# Altium schematic sheet Sheet1.SchDoc
size A4; ENG_APP_DATE: --/--/--; DSN_APP_DATE: --/--/--; CHK_APP_DATE: --/--/--; CheckedBy: CT-Energys; Author: CT-Energys; CompanyName: HTD COMPANY LIMITED; DrawnBy: CHITOAN; Engineer: CHITOAN; Organization: Altium Limited; Address1: HO CHI MINH CITY; Address2: VIETNAM; SheetNumber: 1; SheetTotal: 18
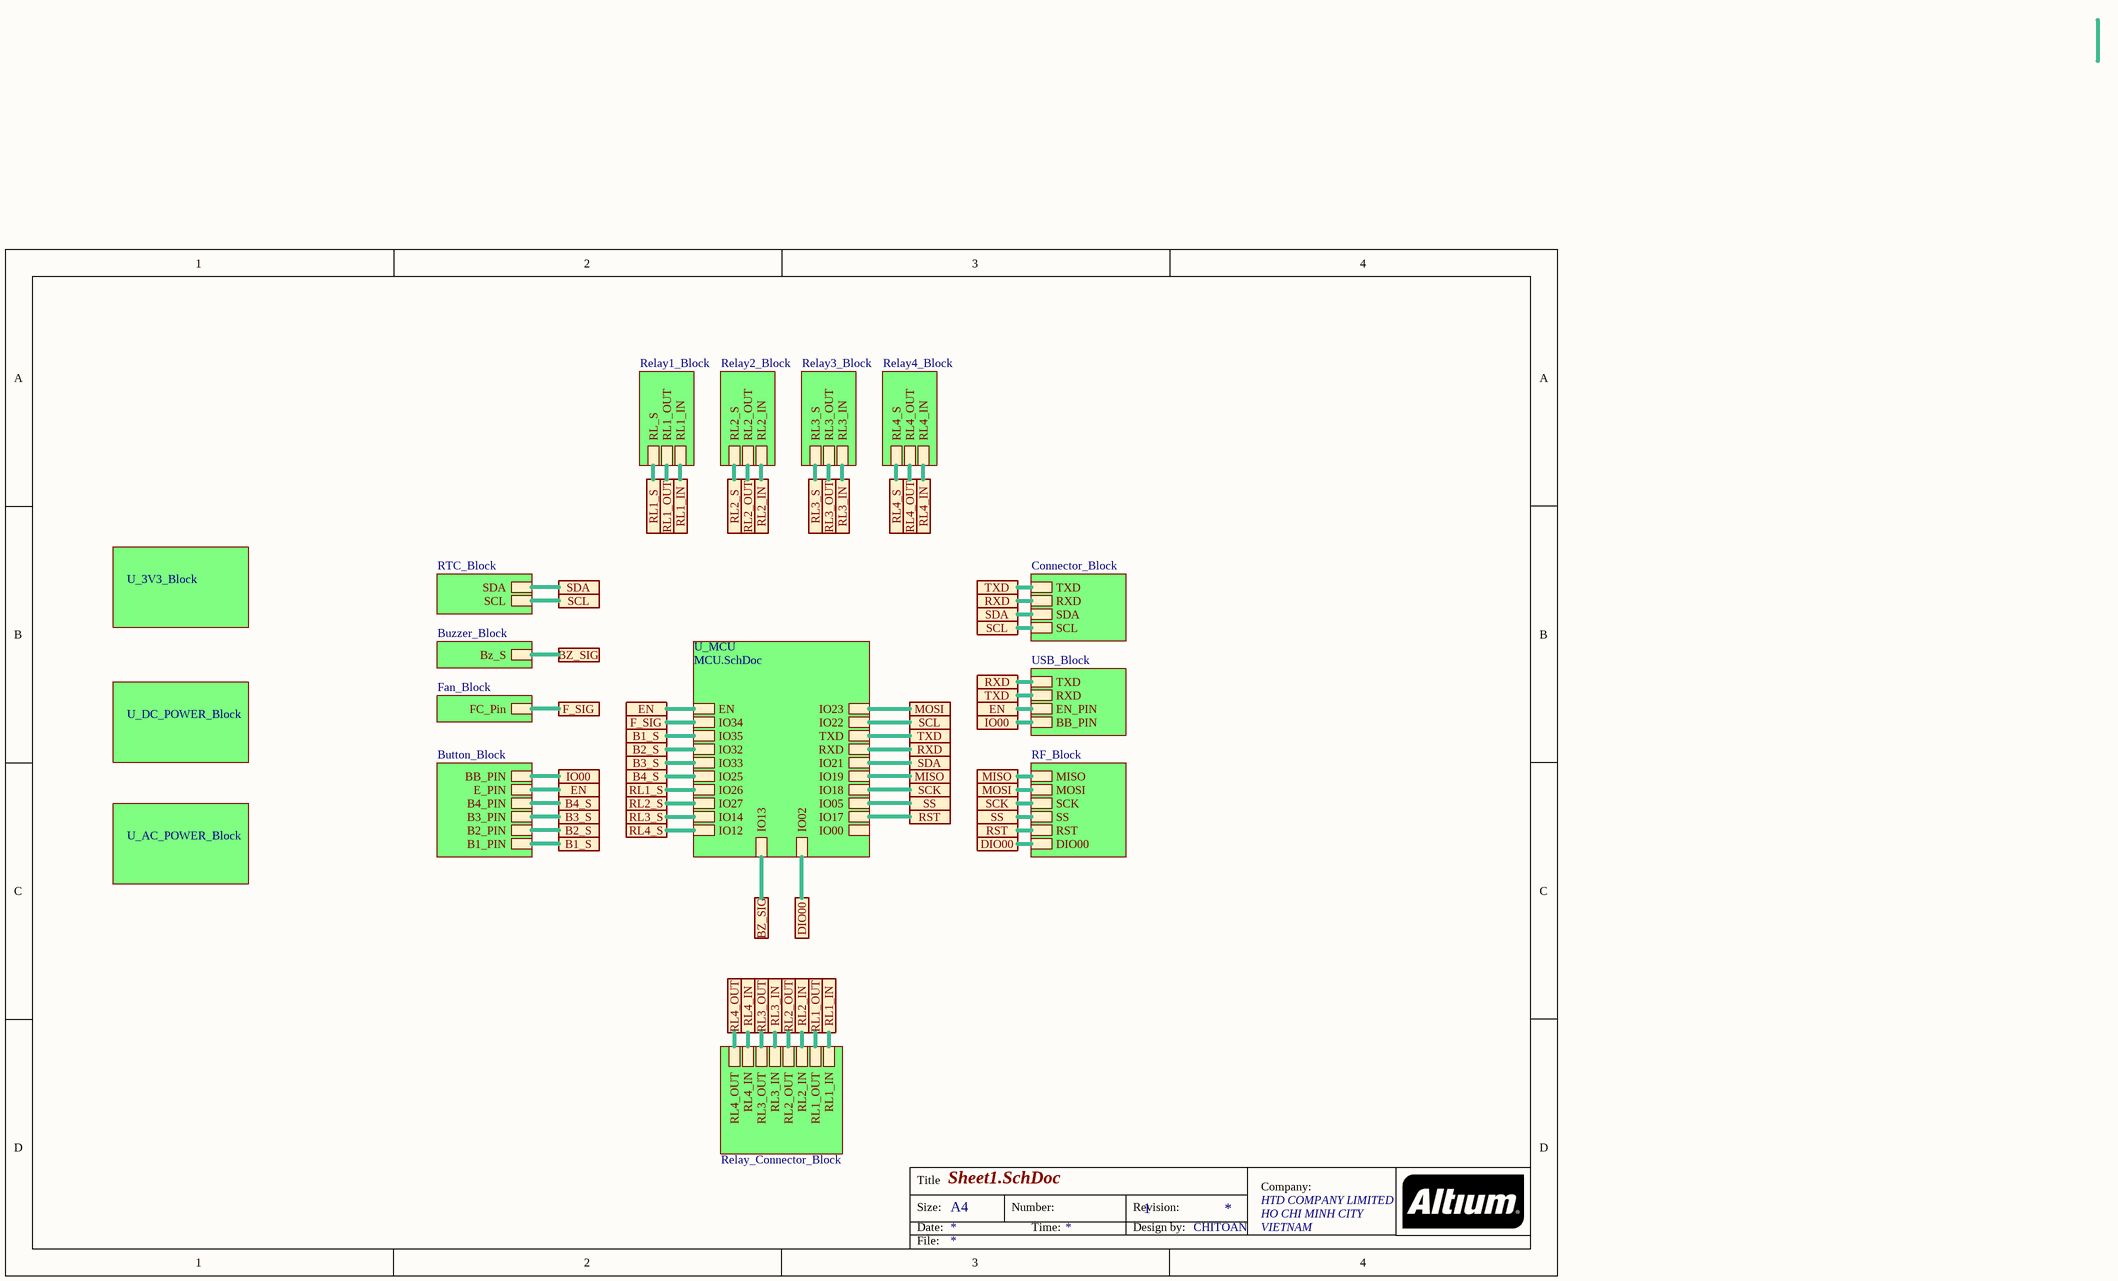
[diagram p0: Sheet1.SchDoc]

## Sub-sheets
Button_Block = Button_Block.SchDoc: B1_PIN, B2_PIN, B3_PIN, E_PIN, BB_PIN, B4_PIN
Buzzer_Block = Buzzer_Block.SchDoc: Bz_S
Connector_Block = Connector_Block.SchDoc: TXD, RXD, SDA, SCL
Fan_Block = Fan_Block.SchDoc: FC_Pin
Relay1_Block = Relay1_Block.SchDoc: RL_S, RL1_OUT, RL1_IN
Relay2_Block = Relay2_Block.SchDoc: RL2_S, RL2_OUT, RL2_IN
Relay3_Block = Relay3_Block.SchDoc: RL3_S, RL3_OUT, RL3_IN
Relay4_Block = Relay4_Block.SchDoc: RL4_S, RL4_OUT, RL4_IN
Relay_Connector_Block = Relay_Connector_Block.SchDoc: RL1_IN, RL1_OUT, RL2_IN, RL2_OUT, RL3_IN, RL3_OUT, RL4_IN, RL4_OUT
RF_Block = RF_Block.SchDoc: MISO, MOSI, SCK, SS, RST, DIO00
RTC_Block = RTC_Block.SchDoc: SCL, SDA
U_3V3_Block = 3V3_Block.SchDoc: no entries
U_AC_POWER_Block = AC_POWER_Block.SchDoc: no entries
U_DC_POWER_Block = DC_POWER_Block.SchDoc: no entries
U_MCU = MCU.SchDoc: EN, IO32, IO33, IO25, IO26, IO27, IO14, IO12, IO02, IO23, IO22, TXD, RXD, IO21, IO19, IO18, IO05, IO17, IO00, IO35, IO34, IO13
USB_Block = USB_Block.SchDoc: TXD, RXD, EN_PIN, BB_PIN

## Ports
B1_S, B2_S, B3_S, B4_S, BZ_SIG, DIO00, EN, F_SIG, IO00, MISO, MOSI, RL1_IN, RL1_OUT, RL1_S, RL2_IN, RL2_OUT, RL2_S, RL3_IN, RL3_OUT, RL3_S, RL4_IN, RL4_OUT, RL4_S, RST, RXD, SCK, SCL, SDA, SS, TXD

## Nets
B1_S: port B1_S, sheet Button_Block/B1_PIN, sheet U_MCU/IO35
B2_S: port B2_S, sheet Button_Block/B2_PIN, sheet U_MCU/IO32
B3_S: port B3_S, sheet Button_Block/B3_PIN, sheet U_MCU/IO33
B4_S: port B4_S, sheet Button_Block/B4_PIN, sheet U_MCU/IO25
BZ_SIG: port BZ_SIG, sheet Buzzer_Block/Bz_S, sheet U_MCU/IO13
DIO00: port DIO00, sheet RF_Block/DIO00, sheet U_MCU/IO02
EN: port EN, sheet USB_Block/EN_PIN, sheet Button_Block/E_PIN, sheet U_MCU/EN
F_SIG: port F_SIG, sheet Fan_Block/FC_Pin, sheet U_MCU/IO34
IO00: port IO00, sheet USB_Block/BB_PIN, sheet Button_Block/BB_PIN
MISO: port MISO, sheet RF_Block/MISO, sheet U_MCU/IO19
MOSI: port MOSI, sheet RF_Block/MOSI, sheet U_MCU/IO23
RL1_IN: port RL1_IN, sheet Relay1_Block/RL1_IN, sheet Relay_Connector_Block/RL1_IN
RL1_OUT: port RL1_OUT, sheet Relay1_Block/RL1_OUT, sheet Relay_Connector_Block/RL1_OUT
RL1_S: port RL1_S, sheet Relay1_Block/RL_S, sheet U_MCU/IO26
RL2_IN: port RL2_IN, sheet Relay2_Block/RL2_IN, sheet Relay_Connector_Block/RL2_IN
RL2_OUT: port RL2_OUT, sheet Relay2_Block/RL2_OUT, sheet Relay_Connector_Block/RL2_OUT
RL2_S: port RL2_S, sheet Relay2_Block/RL2_S, sheet U_MCU/IO27
RL3_IN: port RL3_IN, sheet Relay3_Block/RL3_IN, sheet Relay_Connector_Block/RL3_IN
RL3_OUT: port RL3_OUT, sheet Relay3_Block/RL3_OUT, sheet Relay_Connector_Block/RL3_OUT
RL3_S: port RL3_S, sheet Relay3_Block/RL3_S, sheet U_MCU/IO14
RL4_IN: port RL4_IN, sheet Relay4_Block/RL4_IN, sheet Relay_Connector_Block/RL4_IN
RL4_OUT: port RL4_OUT, sheet Relay4_Block/RL4_OUT, sheet Relay_Connector_Block/RL4_OUT
RL4_S: port RL4_S, sheet Relay4_Block/RL4_S, sheet U_MCU/IO12
RST: port RST, sheet RF_Block/RST, sheet U_MCU/IO17
RXD: port RXD, sheet USB_Block/TXD, sheet Connector_Block/RXD, sheet U_MCU/RXD
SCK: port SCK, sheet RF_Block/SCK, sheet U_MCU/IO18
SCL: port SCL, sheet RTC_Block/SCL, sheet Connector_Block/SCL, sheet U_MCU/IO22
SDA: port SDA, sheet RTC_Block/SDA, sheet Connector_Block/SDA, sheet U_MCU/IO21
SS: port SS, sheet RF_Block/SS, sheet U_MCU/IO05
TXD: port TXD, sheet USB_Block/RXD, sheet Connector_Block/TXD, sheet U_MCU/TXD

## Notes on the sheet
- Title
- Size:
- Date:
- A4
- Number:
- Time:
- Revision:
- Design by:
- Company:
- File: